# EAGLE design untitled (EAGLE 5.07)
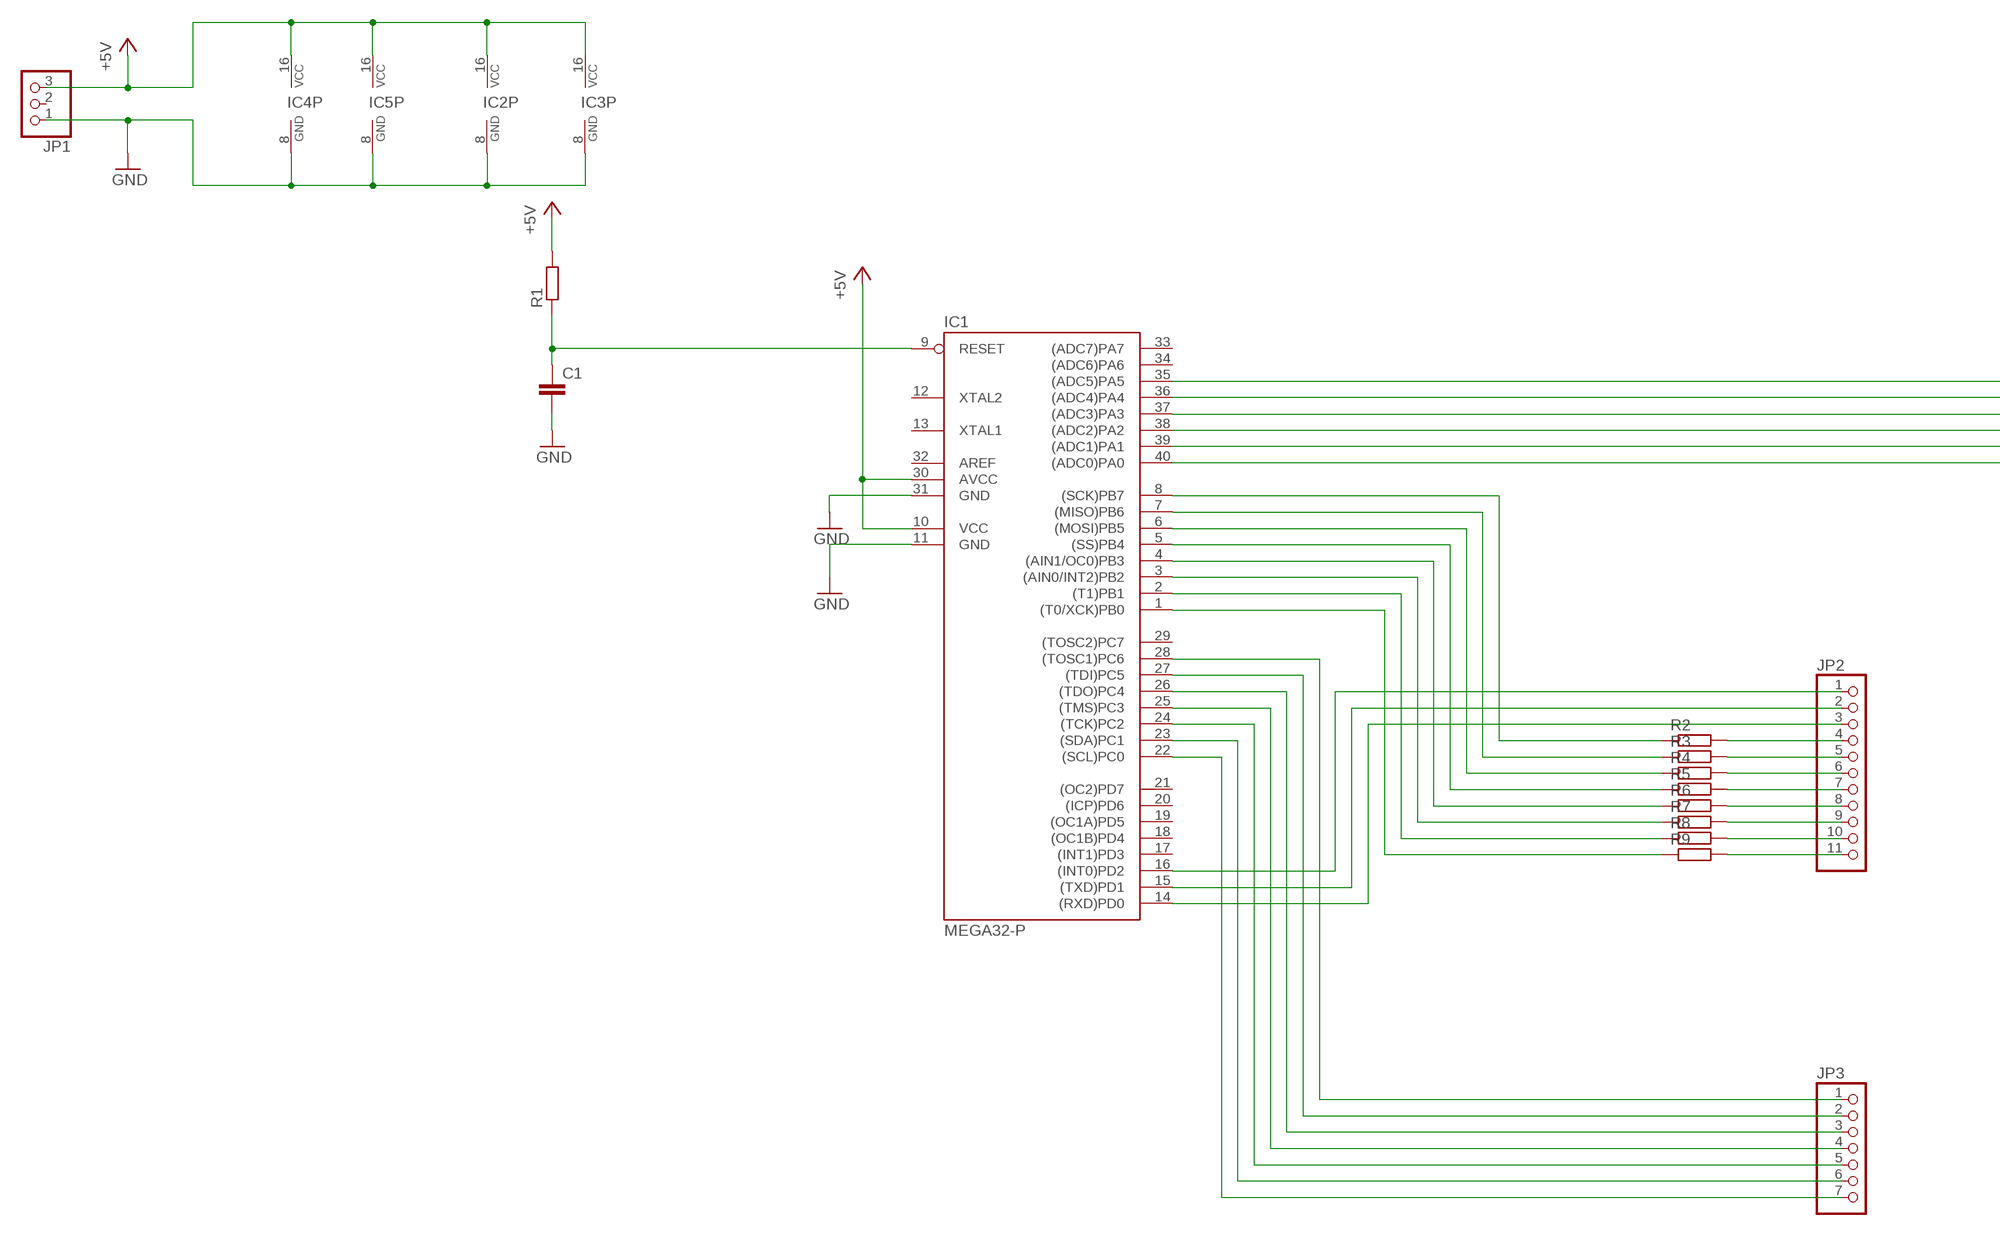
[diagram p0: schematic, sheet 1, part 1 of 2]
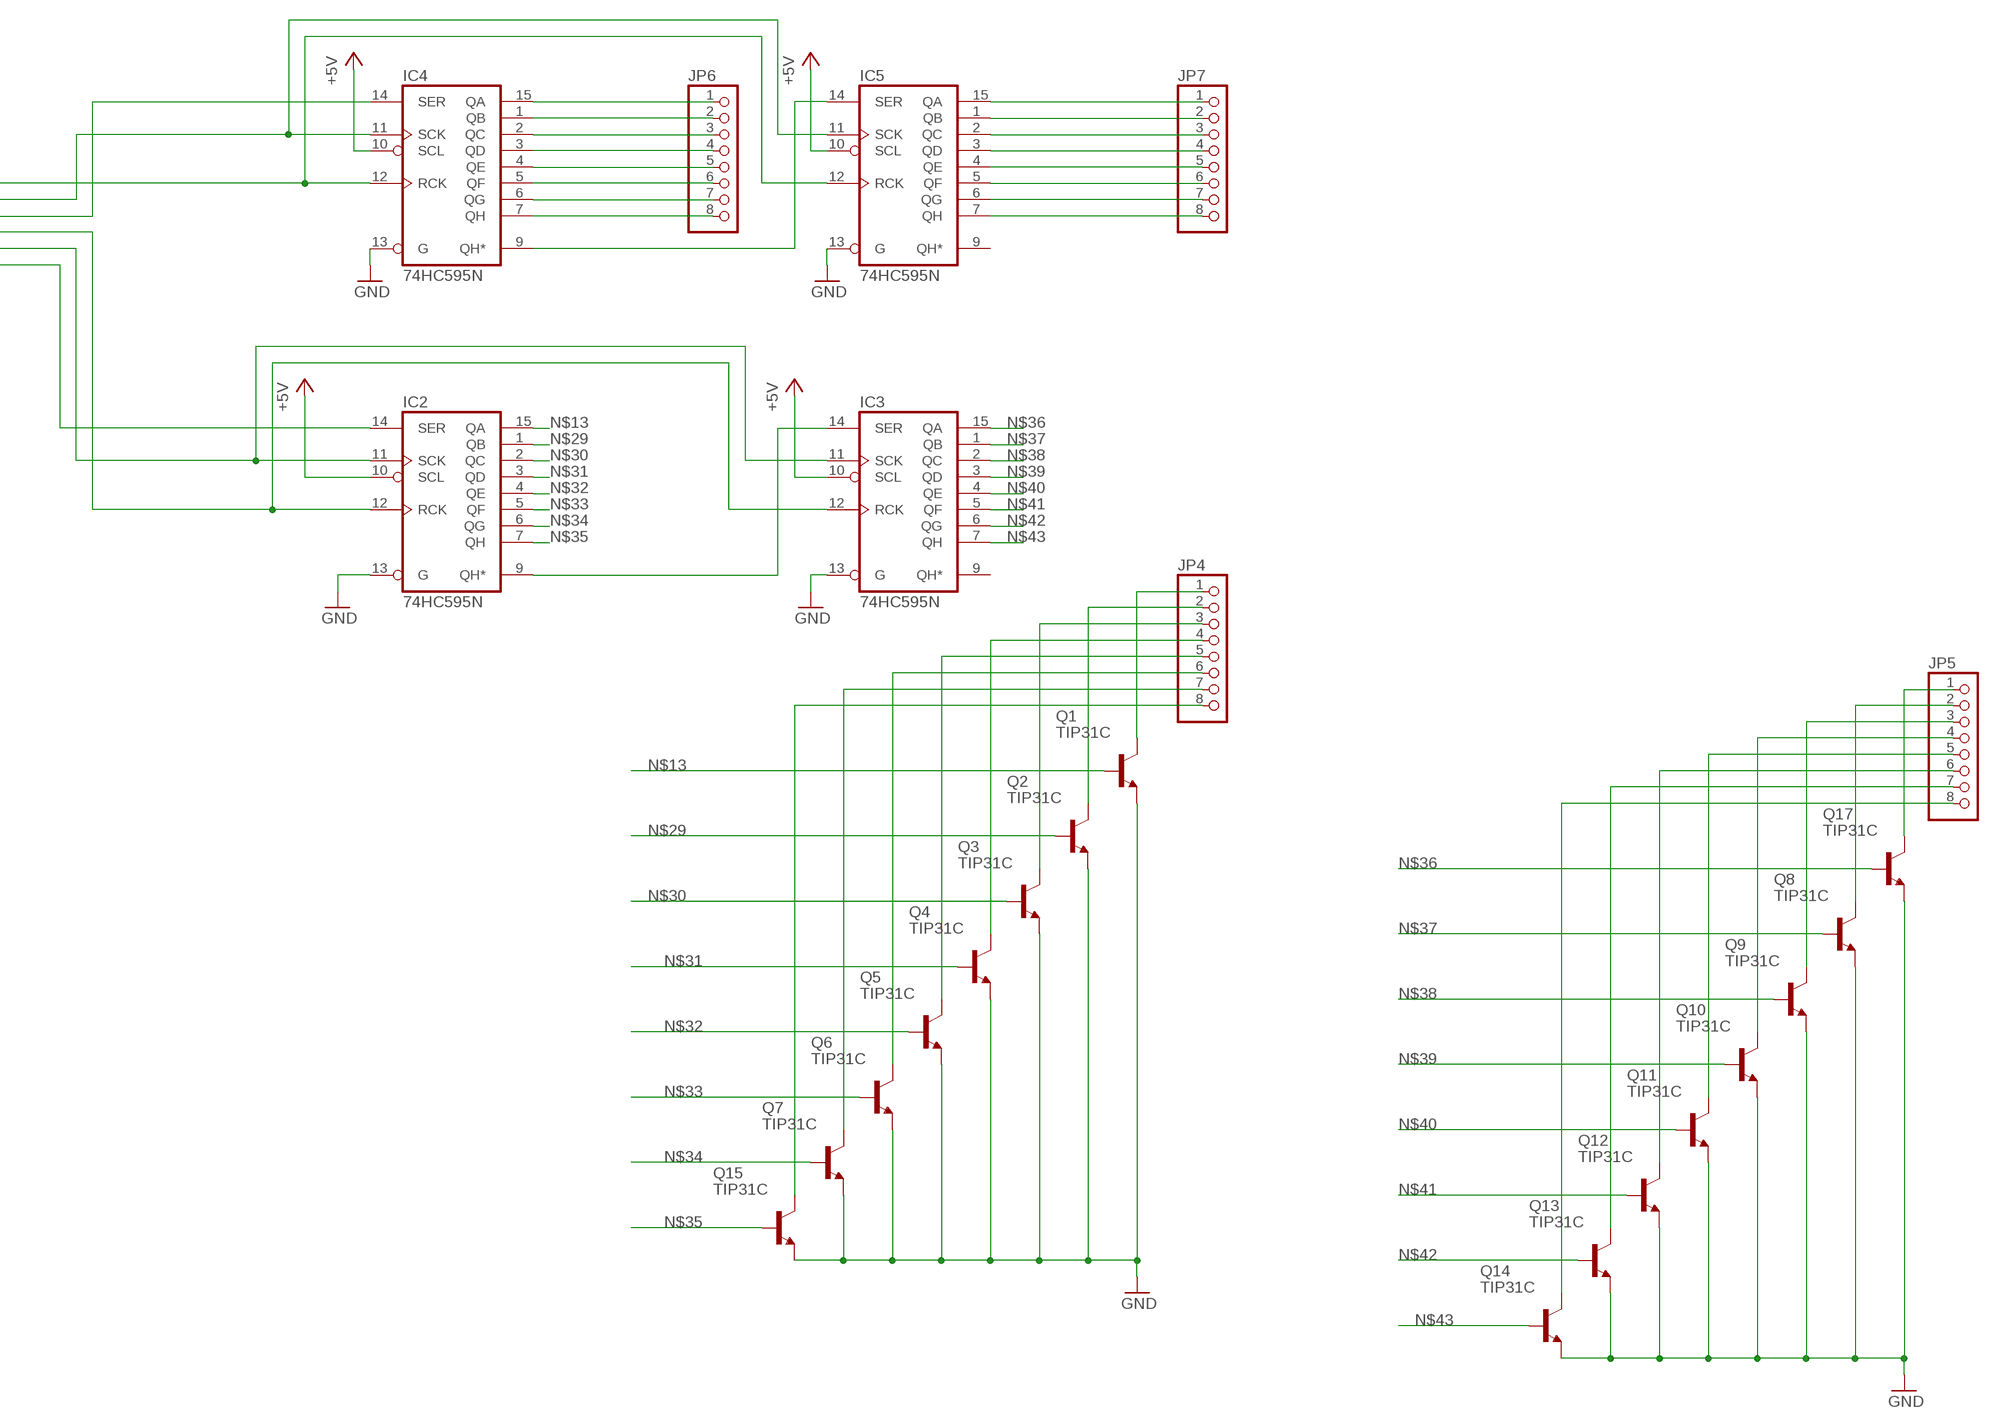
[diagram p1: schematic, sheet 1, part 2 of 2]

## Parts
C1  C-EU050-024X044  [C050-024X044]
IC1  MEGA32-P  [DIL40]
IC2  74HC595N  [DIL16]
IC3  74HC595N  [DIL16]
IC4  74HC595N  [DIL16]
IC5  74HC595N  [DIL16]
JP1  PINHD-1X3/90  [1X03/90]
JP2  PINHD-1X11/90  [1X11/90]
JP3  PINHD-1X7/90  [1X07/90]
JP4  PINHD-1X8/90  [1X08/90]
JP5  PINHD-1X8/90  [1X08/90]
JP6  PINHD-1X8/90  [1X08/90]
JP7  PINHD-1X8/90  [1X08/90]
Q1  TIP31C  [TO220]
Q2  TIP31C  [TO220]
Q3  TIP31C  [TO220]
Q4  TIP31C  [TO220]
Q5  TIP31C  [TO220]
Q6  TIP31C  [TO220]
Q7  TIP31C  [TO220]
Q8  TIP31C  [TO220]
Q9  TIP31C  [TO220]
Q10  TIP31C  [TO220]
Q11  TIP31C  [TO220]
Q12  TIP31C  [TO220]
Q13  TIP31C  [TO220]
Q14  TIP31C  [TO220]
Q15  TIP31C  [TO220]
Q17  TIP31C  [TO220]
R1  R-EU_0204/7  [0204/7]
R2  R-EU_0204/7  [0204/7]
R3  R-EU_0204/7  [0204/7]
R4  R-EU_0204/7  [0204/7]
R5  R-EU_0204/7  [0204/7]
R6  R-EU_0204/7  [0204/7]
R7  R-EU_0204/7  [0204/7]
R8  R-EU_0204/7  [0204/7]
R9  R-EU_0204/7  [0204/7]

## Nets
+5V: IC1.10(VCC) IC1.30(AVCC) IC2.10(SCL) IC2.16(VCC) IC3.10(SCL) IC3.16(VCC) IC4.10(SCL) IC4.16(VCC) IC5.10(SCL) IC5.16(VCC) JP1.3 R1.2
GND: C1.2 IC1.11(GND) IC1.31(GND) IC2.8(GND) IC2.13(G) IC3.8(GND) IC3.13(G) IC4.8(GND) IC4.13(G) IC5.8(GND) IC5.13(G) JP1.1 Q1.3(E) Q2.3(E) Q3.3(E) Q4.3(E) Q5.3(E) Q6.3(E) Q7.3(E) Q8.3(E) Q9.3(E) Q10.3(E) Q11.3(E) Q12.3(E) Q13.3(E) Q14.3(E) Q15.3(E) Q17.3(E)
N$1: IC2.9(QH*) IC3.14(SER)
N$2: IC1.40((ADC0)PA0) IC2.14(SER)
N$3: IC1.39((ADC1)PA1) IC2.11(SCK) IC3.11(SCK)
N$4: IC1.38((ADC2)PA2) IC2.12(RCK) IC3.12(RCK)
N$5: IC1.37((ADC3)PA3) IC4.14(SER)
N$6: IC1.36((ADC4)PA4) IC4.11(SCK) IC5.11(SCK)
N$7: IC1.35((ADC5)PA5) IC4.12(RCK) IC5.12(RCK)
N$8: IC4.9(QH*) IC5.14(SER)
N$9: C1.1 IC1.9(RESET) R1.1
N$10: IC1.14((RXD)PD0) JP2.3
N$11: IC1.15((TXD)PD1) JP2.2
N$12: IC1.16((INT0)PD2) JP2.1
N$13: IC2.15(QA) Q1.1(B)
N$14: IC1.8((SCK)PB7) R2.1
N$15: IC1.7((MISO)PB6) R3.1
N$16: IC1.6((MOSI)PB5) R4.1
N$17: IC1.5((SS)PB4) R5.1
N$18: IC1.4((AIN1/OC0)PB3) R6.1
N$19: IC1.3((AIN0/INT2)PB2) R7.1
N$20: IC1.2((T1)PB1) R8.1
N$21: IC1.1((T0/XCK)PB0) R9.1
N$22: IC1.22((SCL)PC0) JP3.7
N$23: IC1.23((SDA)PC1) JP3.6
N$24: IC1.24((TCK)PC2) JP3.5
N$25: IC1.25((TMS)PC3) JP3.4
N$26: IC1.26((TDO)PC4) JP3.3
N$27: IC1.27((TDI)PC5) JP3.2
N$28: IC1.28((TOSC1)PC6) JP3.1
N$29: IC2.1(QB) Q2.1(B)
N$30: IC2.2(QC) Q3.1(B)
N$31: IC2.3(QD) Q4.1(B)
N$32: IC2.4(QE) Q5.1(B)
N$33: IC2.5(QF) Q6.1(B)
N$34: IC2.6(QG) Q7.1(B)
N$35: IC2.7(QH) Q15.1(B)
N$36: IC3.15(QA) Q17.1(B)
N$37: IC3.1(QB) Q8.1(B)
N$38: IC3.2(QC) Q9.1(B)
N$39: IC3.3(QD) Q10.1(B)
N$40: IC3.4(QE) Q11.1(B)
N$41: IC3.5(QF) Q12.1(B)
N$42: IC3.6(QG) Q13.1(B)
N$43: IC3.7(QH) Q14.1(B)
N$44: JP4.1 Q1.2(C)
N$45: JP4.2 Q2.2(C)
N$46: JP4.3 Q3.2(C)
N$47: JP4.4 Q4.2(C)
N$48: JP4.5 Q5.2(C)
N$49: JP4.6 Q6.2(C)
N$50: JP4.7 Q7.2(C)
N$51: JP4.8 Q15.2(C)
N$53: JP5.1 Q17.2(C)
N$54: JP5.2 Q8.2(C)
N$55: JP5.3 Q9.2(C)
N$56: JP5.4 Q10.2(C)
N$57: JP5.5 Q11.2(C)
N$58: JP5.6 Q12.2(C)
N$59: JP5.7 Q13.2(C)
N$60: IC4.15(QA) JP6.1
N$61: IC4.1(QB) JP6.2
N$62: IC4.2(QC) JP6.3
N$63: IC4.3(QD) JP6.4
N$64: IC4.4(QE) JP6.5
N$65: IC4.5(QF) JP6.6
N$66: IC4.6(QG) JP6.7
N$67: IC4.7(QH) JP6.8
N$68: IC5.15(QA) JP7.1
N$69: IC5.1(QB) JP7.2
N$70: IC5.2(QC) JP7.3
N$71: IC5.3(QD) JP7.4
N$72: IC5.4(QE) JP7.5
N$73: IC5.5(QF) JP7.6
N$74: IC5.6(QG) JP7.7
N$75: IC5.7(QH) JP7.8
N$76: JP2.4 R2.2
N$77: JP2.5 R3.2
N$78: JP2.6 R4.2
N$79: JP2.7 R5.2
N$80: JP2.8 R6.2
N$81: JP2.9 R7.2
N$82: JP2.10 R8.2
N$83: JP2.11 R9.2
N$84: JP5.8 Q14.2(C)
Unconnected: IC1.12(XTAL2) IC1.13(XTAL1) IC1.17((INT1)PD3) IC1.18((OC1B)PD4) IC1.19((OC1A)PD5) IC1.20((ICP)PD6) IC1.21((OC2)PD7) IC1.29((TOSC2)PC7) IC1.32(AREF) IC1.33((ADC7)PA7) IC1.34((ADC6)PA6) IC3.9(QH*) IC5.9(QH*) JP1.2

## Library data of the parts
C1 = rcl:C-EU: CAPACITOR, European symbol
IC1 = atmel:MEGA32-P: MICROCONTROLLER 32 Kbytes FLASH 2 Kbytes SRAM 1 Kbytes EEPROM USART 8-channel 10 bit ADC Source: www.atmel.com .. doc2503.pdf
IC2-IC5 = 74xx-eu:74*595: 8-bit SHIFT REGISTER, output latch
JP1 = pinhead:PINHD-1X3: PIN HEADER
JP2 = pinhead:PINHD-1X11: PIN HEADER
JP3 = pinhead:PINHD-1X7: PIN HEADER
JP4-JP7 = pinhead:PINHD-1X8: PIN HEADER
Q1-Q15 Q17 = transistor-npn:TIP31C*: NPN Transistor
R1-R9 = rcl:R-EU_: RESISTOR, European symbol

## Board
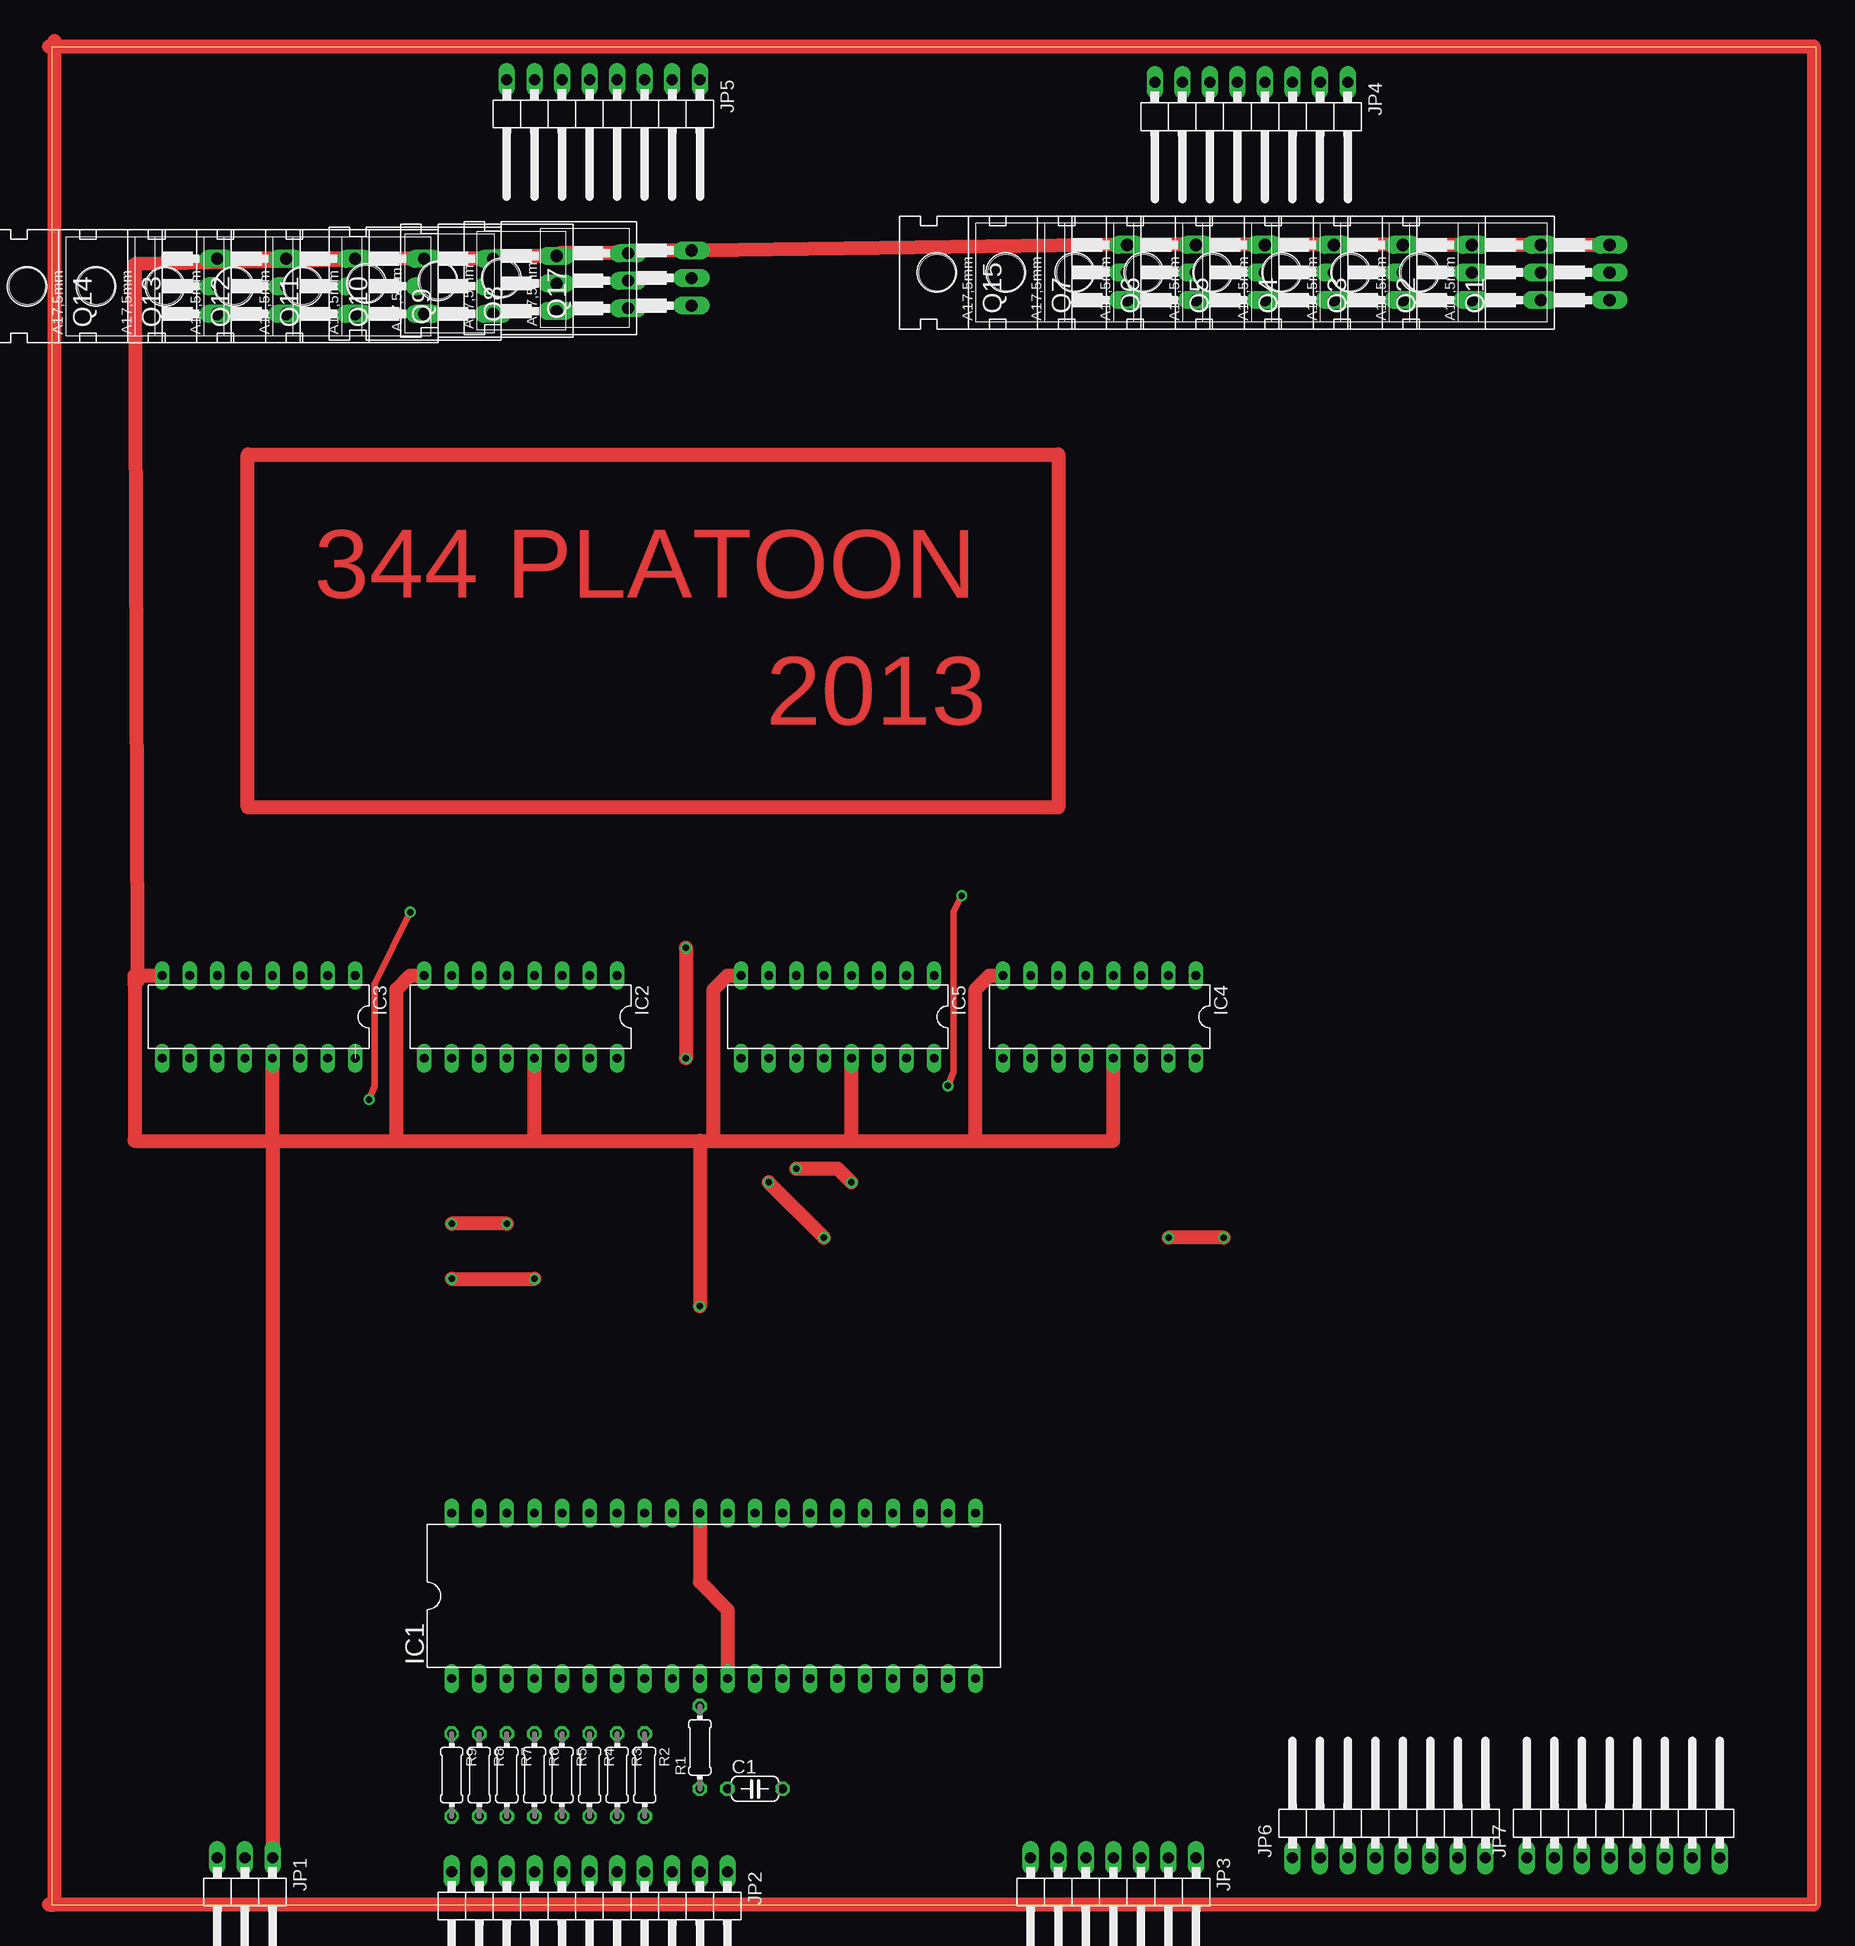
[diagram p2: board, top side]
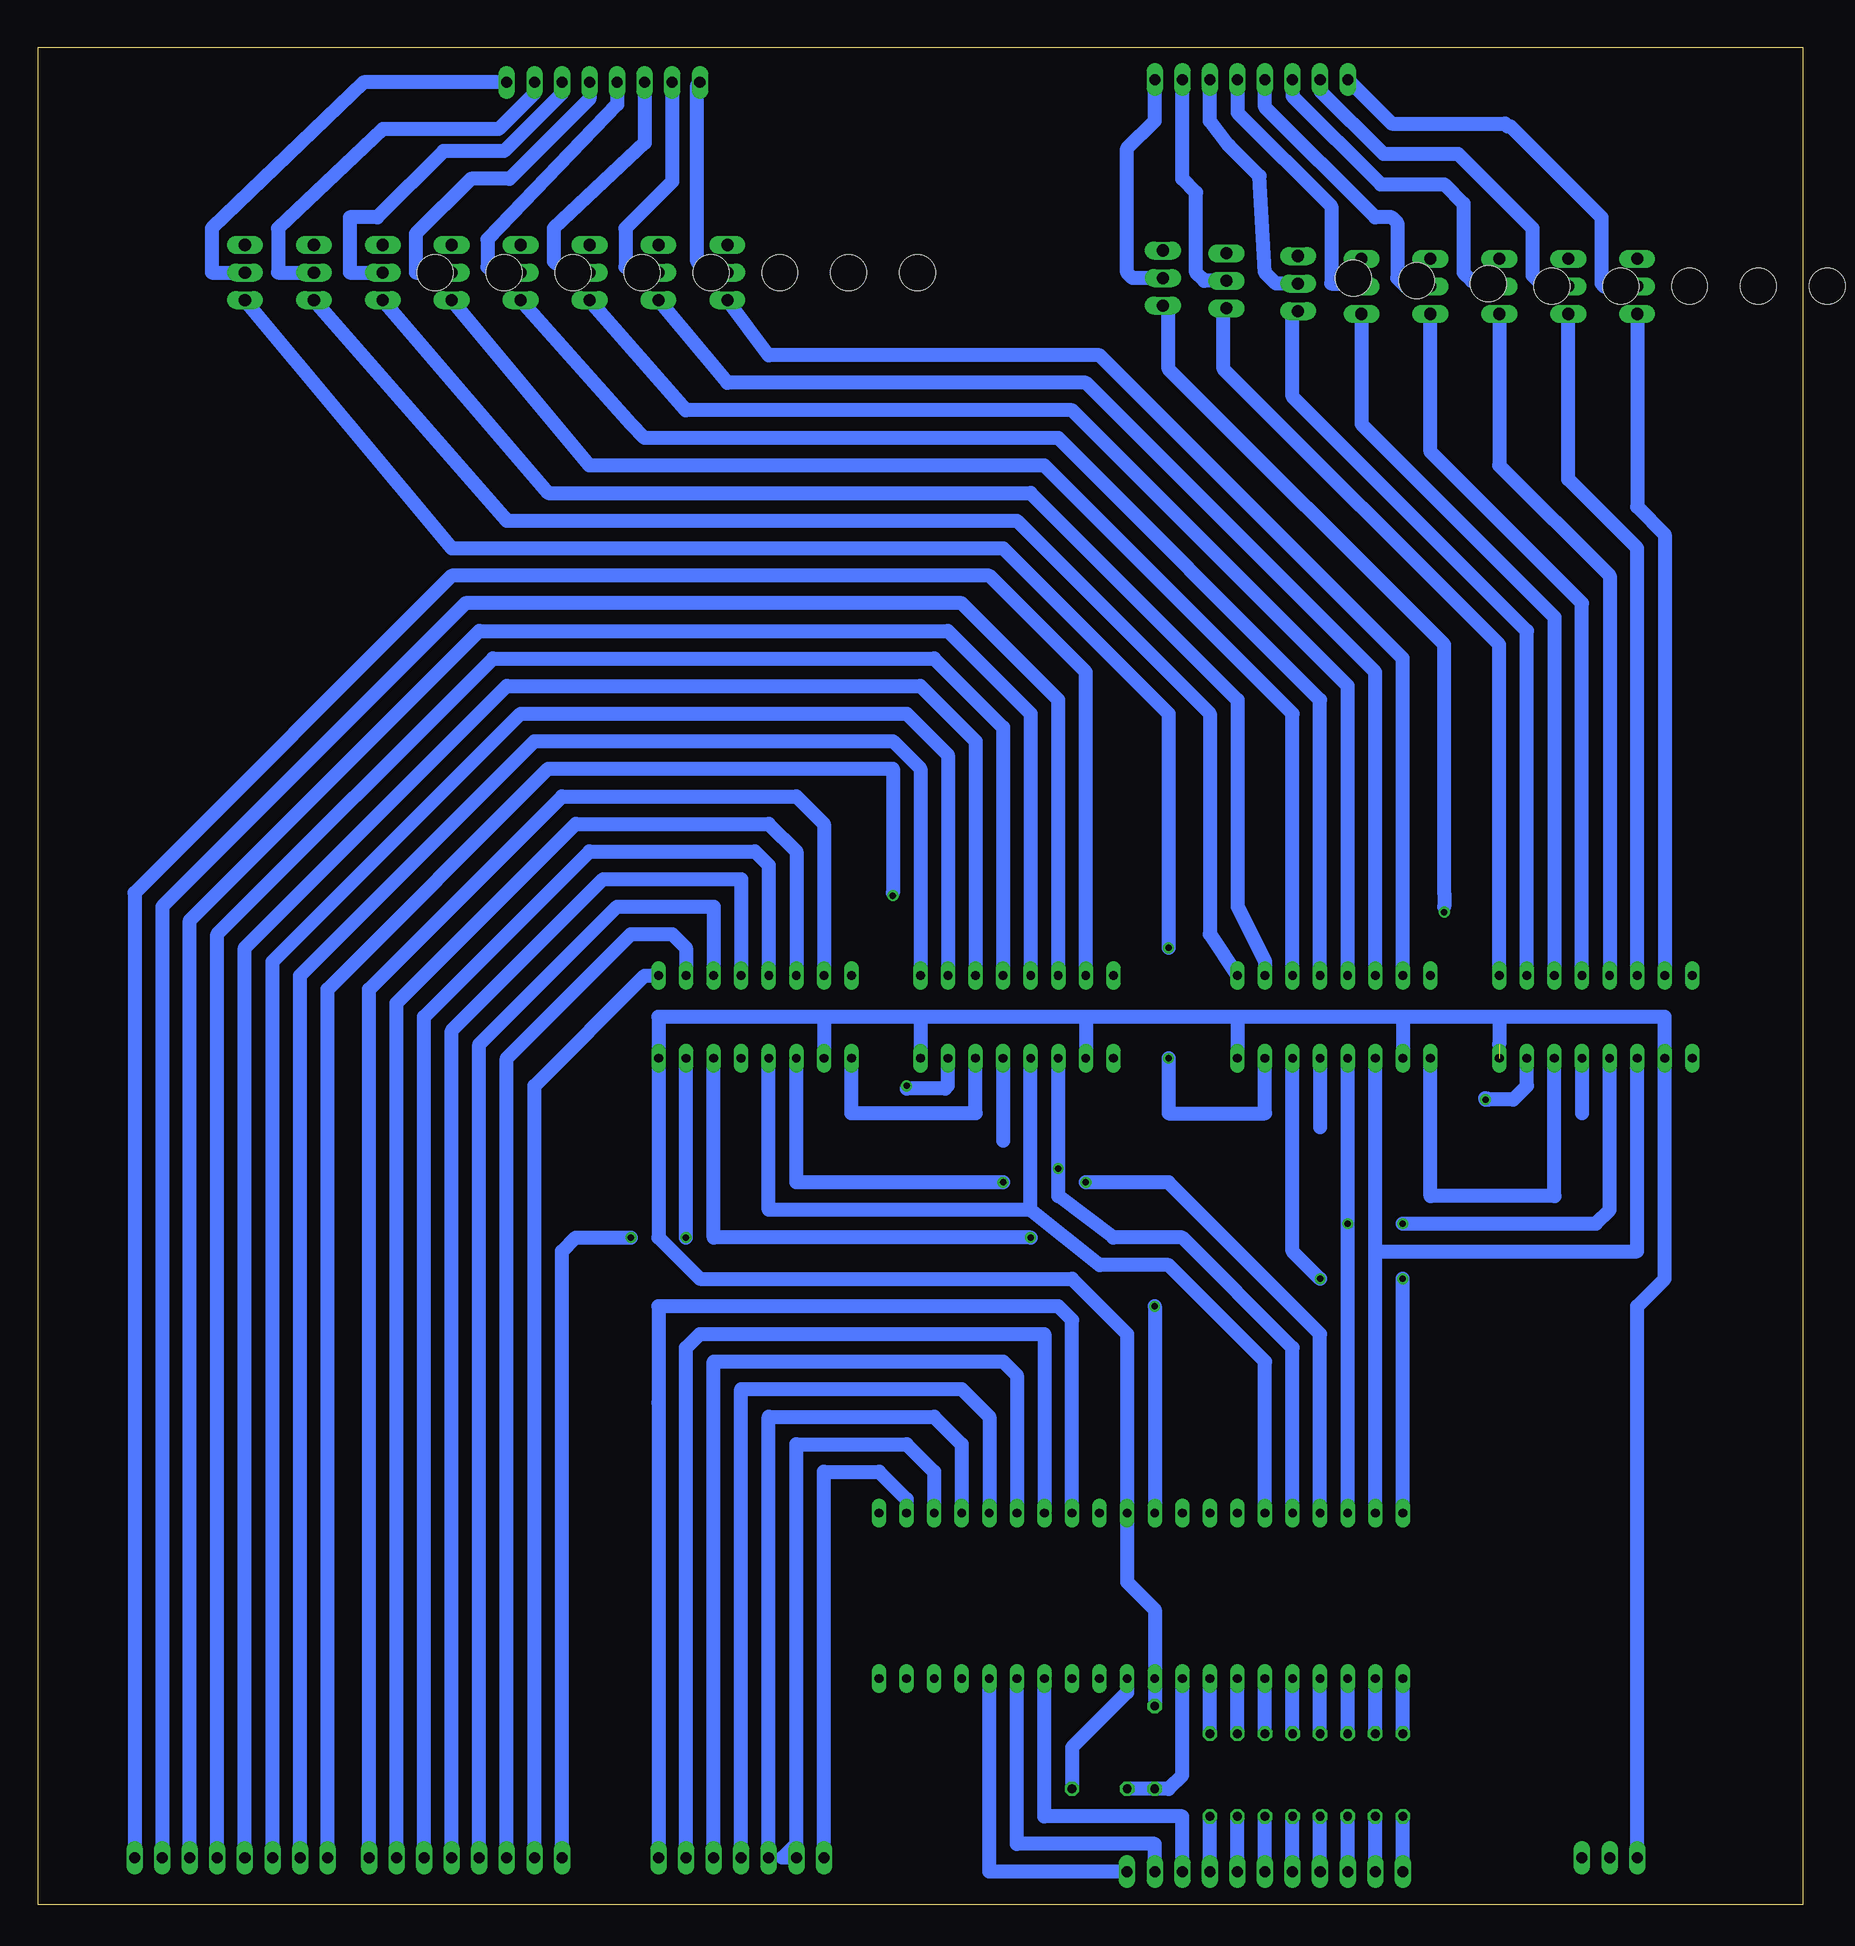
[diagram p3: board, bottom side, seen from below]

Size 162.54 x 171.12 mm. Coordinates in mm from the lower left corner, seen from the top.
Outline: 0,0 162.54,0 162.54,171.12 0,171.12 0,0
Copper layers (1*16): Top 0.035mm / dielectric 1.5mm / Bottom 0.035mm
Design rules "default *": minimum track width 10mil, minimum drill 24mil, track to track 8mil, track to pad 8mil, pad to pad 8mil, via to via 8mil, smd to smd 8mil, copper to edge 40mil, drill to drill 8mil, minimum pad ring 10mil, minimum via ring 8mil, stop-mask expansion 4mil, vias tented up to drill 0mil, thermal gap 10mil

### Footprints (pad centres in the part's own frame; a part is rotated, then mirrored left to right if it is on the bottom)
C050-024X044 = drill 0.813 octagon: 1 -2.54,0; 2 2.54,0
DIL40 = drill 0.813 long: 1 -24.13,-7.62; 2 -21.59,-7.62; 3 -19.05,-7.62; 4 -16.51,-7.62; 5 -13.97,-7.62; 6 -11.43,-7.62; 7 -8.89,-7.62; 8 -6.35,-7.62; 9 -3.81,-7.62; 10 -1.27,-7.62; 11 1.27,-7.62; 12 3.81,-7.62; 13 6.35,-7.62; 14 8.89,-7.62; 15 11.43,-7.62; 16 13.97,-7.62; 17 16.51,-7.62; 18 19.05,-7.62; 19 21.59,-7.62; 20 24.13,-7.62; 21 24.13,7.62; 22 21.59,7.62; 23 19.05,7.62; 24 16.51,7.62; 25 13.97,7.62; 26 11.43,7.62; 27 8.89,7.62; 28 6.35,7.62; 29 3.81,7.62; 30 1.27,7.62; 31 -1.27,7.62; 32 -3.81,7.62; 33 -6.35,7.62; 34 -8.89,7.62; 35 -11.43,7.62; 36 -13.97,7.62; 37 -16.51,7.62; 38 -19.05,7.62; 39 -21.59,7.62; 40 -24.13,7.62
DIL16 = drill 0.813 long: 1 -8.89,-3.81; 2 -6.35,-3.81; 3 -3.81,-3.81; 4 -1.27,-3.81; 5 1.27,-3.81; 6 3.81,-3.81; 7 6.35,-3.81; 8 8.89,-3.81; 9 8.89,3.81; 10 6.35,3.81; 11 3.81,3.81; 12 1.27,3.81; 13 -1.27,3.81; 14 -3.81,3.81; 15 -6.35,3.81; 16 -8.89,3.81
1X03/90 = drill 1.016 long: 1 -2.54,-3.81; 2 0,-3.81; 3 2.54,-3.81
1X11/90 = drill 1.016 long: 1 -12.7,-3.81; 2 -10.16,-3.81; 3 -7.62,-3.81; 4 -5.08,-3.81; 5 -2.54,-3.81; 6 0,-3.81; 7 2.54,-3.81; 8 5.08,-3.81; 9 7.62,-3.81; 10 10.16,-3.81; 11 12.7,-3.81
1X07/90 = drill 1.016 long: 1 -7.62,-3.81; 2 -5.08,-3.81; 3 -2.54,-3.81; 4 0,-3.81; 5 2.54,-3.81; 6 5.08,-3.81; 7 7.62,-3.81
1X08/90 = drill 1.016 long: 1 -8.89,-3.81; 2 -6.35,-3.81; 3 -3.81,-3.81; 4 -1.27,-3.81; 5 1.27,-3.81; 6 3.81,-3.81; 7 6.35,-3.81; 8 8.89,-3.81
TO220 = drill 1.118 long: 1 -2.54,-6.35; 2 0,-6.35; 3 2.54,-6.35 | hole 3.302: 0,11.176
0204/7 = drill 0.813 octagon: 1 -3.81,0; 2 3.81,0

### Placement (x,y rotation side)
C1  64.77,10.67 0 top
IC1  60.96,28.45 0 top
IC2  43.18,81.79 180 top
IC3  19.05,81.79 180 top
IC4  96.52,81.79 180 top
IC5  72.39,81.79 180 top
JP1  17.78,0.51 180 top
JP2  49.53,-0.76 180 top
JP3  97.79,0.51 180 top
JP4  110.49,164.08 180 top
JP5  50.8,164.34 180 top
JP6  123.19,8.13 0 top
JP7  144.78,8.13 0 top
Q1  137.16,150.37 90 top
Q2  130.81,150.37 90 top
Q3  124.46,150.37 90 top
Q4  118.11,150.37 90 top
Q5  111.76,150.37 90 top
Q6  105.41,150.37 90 top
Q7  99.06,150.37 90 top
Q8  46.74,149.61 90 top
Q9  40.13,149.35 90 top
Q10  34.29,149.1 90 top
Q11  27.94,149.1 90 top
Q12  21.59,149.1 90 top
Q13  15.24,149.1 90 top
Q14  8.89,149.1 90 top
Q15  92.71,150.37 90 top
Q17  52.58,149.86 90 top
R1  59.69,14.48 90 top
R2  54.61,11.94 270 top
R3  52.07,11.94 270 top
R4  49.53,11.94 270 top
R5  46.99,11.94 270 top
R6  44.45,11.94 270 top
R7  41.91,11.94 270 top
R8  39.37,11.94 270 top
R9  36.83,11.94 270 top

### Tracks (layer width: path | path; a pad name or v marks a point on that pad's centre or on a via)
+5V  (1 unrouted)
  Bottom 1.27: R1.2 IC1.10 59.69,27.18 62.23,29.72 IC1.30 62.23,52.58 67.31,57.66 101.6,57.66 105.41,61.47 IC4.16 105.41,81.79 90.17,81.79 | JP1.3 15.24,55.12 12.7,57.66 IC3.10 12.7,81.79 27.94,81.79 | 36.83,81.79 IC2.10 | 27.94,81.79 36.83,81.79 | 27.94,81.79 27.94,79.25 | 36.83,81.79 52.07,81.79 | 52.07,81.79 IC2.16 | 52.07,81.79 66.04,81.79 | 90.17,81.79 IC4.10 | 81.28,81.79 IC5.16 | 81.28,81.79 90.17,81.79 | 66.04,81.79 IC5.10 | 66.04,81.79 81.28,81.79
GND  (via drill 0.6)
  Top 1.27: 20.32,70.36 JP1.1 | IC3.8 7.62,85.6 7.62,84.84 | 7.62,84.84 7.62,70.36 20.32,70.36 | 20.32,70.36 IC3.13 | IC2.8 33.02,85.6 31.75,84.33 31.75,70.36 | 20.32,70.36 31.75,70.36 | 44.45,70.36 IC2.13 | 31.75,70.36 44.45,70.36 | IC5.8 62.23,85.6 60.96,84.33 60.96,70.36 | 44.45,70.36 59.69,70.36 | 59.69,70.36 60.96,70.36 | 60.96,70.36 73.66,70.36 | 73.66,70.36 IC5.13 | IC4.8 86.36,85.6 85.09,84.33 85.09,70.36 | 73.66,70.36 85.09,70.36 | IC4.13 97.79,70.36 85.09,70.36 | 59.69,70.36 v59.69,55.12 | IC1.31 59.69,29.72 62.23,27.18 IC1.11 | Q1.3 Q2.3 Q3.3 Q4.3 Q5.3 Q6.3 Q7.3 Q15.3 59.94,152.4 Q17.3 53.34,152.4 Q8.3 46.74,152.15 Q9.3 40.89,151.89 Q10.3 Q11.3 | Q11.3 Q12.3 Q13.3 Q14.3 | Q14.3 14.73,151.64 14.48,151.38 14.99,151.38 Q14.3 | Q11.3 7.62,151.13 7.87,87.88 7.87,85.09 7.62,84.84
  Bottom 1.27: C1.2 67.31,14.48 62.23,19.56 IC1.11 | IC2.13 44.45,71.63 | IC3.13 20.32,72.9 | IC5.13 73.66,70.36 | v59.69,55.12 IC1.31
  pour Top: 195.83,98.04 274.07,98.04 274.07,61.47 195.33,61.47 195.33,98.04
N$1
  Bottom 1.27: IC3.14 22.86,65.28 34.29,65.28 IC2.9
N$2  (via drill 0.6)
  Top 1.27: v36.83,57.66 v44.45,57.66
  Bottom 1.27: IC2.14 46.99,60.2 v44.45,57.66 | IC1.40 v36.83,57.66
N$3
  Bottom 1.27: IC1.39 39.37,60.2 | 39.37,60.2 IC2.11 | IC3.11 15.24,60.2 39.37,60.2
N$4  (via drill 0.6)
  Top 1.27: v41.91,62.74 v36.83,62.74
  Bottom 1.27: IC1.38 v41.91,62.74 IC2.12 | IC3.12 17.78,64.01 19.05,62.74 v36.83,62.74
N$5  (via drill 0.6)
  Top 1.27: v66.04,66.55 v71.12,61.47
  Bottom 1.27: IC1.37 44.45,52.58 58.42,66.55 v66.04,66.55 | IC4.14 100.33,61.47 v71.12,61.47
N$6  (via drill 0.6)
  Top 1.27: v73.66,66.55 72.39,67.82 v68.58,67.82
  Bottom 1.27: IC1.36 46.99,51.31 57.15,61.47 63.5,61.47 68.58,65.28 v68.58,67.82 IC5.11 | IC4.11 92.71,66.55 v73.66,66.55
N$7
  Bottom 1.27: IC1.35 49.53,50.04 58.42,58.93 64.77,58.93 71.12,64.01 | 71.12,64.01 IC5.12 | IC4.12 95.25,64.01 71.12,64.01
N$8
  Bottom 1.27: IC5.14 76.2,72.9 87.63,72.9 IC4.9
N$9
  Bottom 1.27: C1.1 R1.1 58.42,10.67 57.15,11.94 IC1.9
N$10
  Bottom 1.27: JP2.3 57.15,8.13 69.85,8.13 IC1.14
N$11
  Bottom 1.27: JP2.2 59.69,5.59 72.39,5.59 IC1.15
N$12
  Bottom 1.27: JP2.1 74.93,3.05 IC1.16
N$13  (via drill 0.6)
  Top 1.27: v58.42,88.14 v58.42,77.98
  Bottom 1.27: IC2.15 49.53,72.9 58.42,72.9 v58.42,77.98 | v58.42,88.14 58.42,109.73 73.66,124.97 124.46,124.97 Q1.1
N$14
  Bottom 1.27: R2.1 IC1.8
N$15
  Bottom 1.27: R3.1 IC1.7
N$16
  Bottom 1.27: R4.1 IC1.6
N$17
  Bottom 1.27: R5.1 IC1.5
N$18
  Bottom 1.27: R6.1 IC1.4
N$19
  Bottom 1.27: R7.1 IC1.3
N$20
  Bottom 1.27: R8.1 IC1.2
N$21
  Bottom 1.27: R9.1 IC1.1
N$22
  Bottom 1.27: IC1.22 82.55,37.34 85.09,39.88 90.17,39.88 90.17,38.61 JP3.7
N$23
  Bottom 1.27: IC1.23 80.01,39.88 82.55,42.42 92.71,42.42 92.71,5.59 93.98,4.32 JP3.6
N$24
  Bottom 1.27: IC1.24 77.47,42.42 80.01,44.96 95.25,44.96 JP3.5
N$25
  Bottom 1.27: IC1.25 74.93,44.96 77.47,47.5 97.79,47.5 JP3.4
N$26
  Bottom 1.27: JP3.3 100.33,50.04 73.66,50.04 72.39,48.77 IC1.26
N$27
  Bottom 1.27: IC1.27 69.85,52.58 101.6,52.58 102.87,51.31 JP3.2
N$28
  Bottom 1.27: IC1.28 67.31,53.85 68.58,55.12 105.41,55.12 105.41,46.23 JP3.1
N$29
  Bottom 1.27: IC2.1 54.61,89.41 54.61,109.73 72.39,127.51 119.38,127.51 Q2.1
N$30
  Bottom 1.27: IC2.2 49.53,86.87 52.07,91.95 52.07,111 71.12,130.05 115.57,130.05 Q3.1
N$31
  Bottom 1.27: IC2.3 46.99,109.73 69.85,132.59 111.76,132.59 Q4.1
N$32
  Bottom 1.27: IC2.4 44.45,111 68.58,135.13 106.68,135.13 107.95,136.4 Q5.1
N$33
  Bottom 1.27: IC2.5 41.91,112.27 67.31,137.67 102.87,137.67 Q6.1
N$34
  Bottom 1.27: IC2.6 39.37,113.54 66.04,140.21 99.06,140.21 Q7.1
N$35
  Bottom 1.27: IC2.7 36.83,114.81 64.77,142.75 95.25,142.75 Q15.1
N$36  (via drill 0.6)
  Top 0.61: v33.02,91.44 29.72,84.84 29.72,75.44 v29.21,74.17
  Bottom 0.61: v33.02,91.44 33.02,91.95
  Bottom 1.27: IC3.15 25.4,75.44 26.67,74.17 28.96,74.17 29.24,74.3 v29.21,74.17 | Q17.1 58.42,146.81 58.42,141.48 33.02,116.08 33.02,93.47 33.02,93.22 33.02,91.95
N$37
  Bottom 1.27: IC3.1 27.94,116.08 53.34,141.48 53.34,146.81 Q8.1
N$38
  Bottom 1.27: IC3.2 25.4,117.35 46.99,138.94 46.99,146.3 Q9.1
N$39
  Bottom 1.27: Q10.1 40.64,136.4 22.86,118.62 IC3.3
N$40
  Bottom 1.27: IC3.4 20.32,119.89 34.29,133.86 Q11.1
N$41
  Bottom 1.27: Q12.1 27.94,132.59 17.78,122.43 IC3.5
N$42
  Bottom 1.27: IC3.6 15.24,124.97 21.59,131.32 Q13.1
N$43
  Bottom 1.27: Q14.1 15.24,128.78 12.7,126.24 IC3.7
N$44
  Bottom 1.27: JP4.1 132.59,167.89 146.56,154.43 146.56,150.37 Q1.2
N$45
  Bottom 1.27: JP4.2 116.84,166.88 120.14,163.58 130.81,163.58 140.46,154.43 140.46,150.37 Q2.2
N$46
  Bottom 1.27: JP4.3 114.3,166.88 119.63,161.54 125.22,161.54 131.32,155.45 133.86,155.45 133.86,150.37 Q3.2
N$47
  Bottom 1.27: JP4.4 111.76,166.37 119.13,159 122.68,159 127.76,153.92 127.76,150.37 Q4.2
N$48
  Bottom 1.27: JP4.5 109.22,165.86 121.16,153.42 121.16,150.88 120.14,150.37 Q5.2
N$49
  Bottom 1.27: JP4.6 106.68,162.31 115.06,154.43 115.06,151.38 113.54,150.37 Q6.2
N$50
  Bottom 1.27: JP4.7 104.14,158.75 108.46,154.43 108.46,150.88 107.95,150.88 107.44,150.37 Q7.2
N$51
  Bottom 1.27: Q15.2 100.84,150.37 101.85,151.38 101.85,167.64 JP4.8
N$52
  Bottom 1.27: 78.99,75.18 82.55,75.18
N$53
  Bottom 1.27: Q17.2 61.72,149.86 62.23,150.37 62.23,161.8 59.69,164.34 JP5.1
N$54
  Bottom 1.27: Q8.2 55.12,149.61 55.88,150.37 55.88,157.73 57.15,159 JP5.2
N$55
  Bottom 1.27: Q9.2 48.51,149.35 49.53,150.37 50.04,159.26 52.83,162.05 54.61,164.34 JP5.3
N$56
  Bottom 1.27: JP5.4 52.07,165.1 43.43,156.46 43.43,149.35 40.89,149.35 Q10.2
N$57
  Bottom 1.27: JP5.5 49.53,165.61 39.37,155.45 37.85,155.45 37.34,154.94 37.34,149.86 36.58,149.1 Q11.2
N$58
  Bottom 1.27: JP5.6 46.99,166.62 38.86,158.5 33.02,158.5 31.24,156.72 31.24,150.37 30.48,149.61 30.23,149.61 29.72,149.1 Q12.2
N$59
  Bottom 1.27: JP5.7 44.45,167.13 38.61,161.29 31.75,161.29 24.89,154.43 24.89,150.11 23.88,149.1 Q13.2
N$60  (via drill 0.6)
  Top 1.27: v107.95,61.47 v102.87,61.47
  Bottom 1.27: v107.95,61.47 113.03,61.47 114.3,60.2 JP6.1 | v102.87,61.47 IC4.15
N$61
  Bottom 1.27: IC4.1 106.68,85.6 116.84,75.44 JP6.2
N$62
  Bottom 1.27: IC4.2 102.87,88.14 104.14,89.41 107.95,89.41 119.38,77.98 JP6.3
N$63
  Bottom 1.27: JP6.4 121.92,79.25 109.22,91.95 100.33,91.95 IC4.3
N$64
  Bottom 1.27: IC4.4 97.79,94.49 110.49,94.49 124.46,80.52 JP6.5
N$65
  Bottom 1.27: JP6.6 127,81.79 111.76,97.03 96.52,97.03 95.25,95.76 IC4.5
N$66
  Bottom 1.27: IC4.6 92.71,97.03 95.25,99.57 113.03,99.57 129.54,83.06 JP6.7
N$67
  Bottom 1.27: JP6.8 132.08,84.33 114.3,102.11 92.71,102.11 90.17,99.57 IC4.7
N$68  (via drill 0.6)
  Top 0.61: v82.55,75.44 83.06,76.71 83.06,91.44 v83.82,92.96
  Bottom 0.61: v82.55,75.44 78.74,75.44 | 83.82,93.22 v83.82,92.96
  Bottom 1.27: 78.74,75.44 IC5.15 | JP7.1 135.89,84.33 115.57,104.65 83.82,104.65 83.82,93.22
N$69
  Bottom 1.27: JP7.2 138.43,85.6 116.84,107.19 83.82,107.19 81.28,104.65 IC5.1
N$70
  Bottom 1.27: IC5.2 78.74,105.92 82.55,109.73 118.11,109.73 140.97,86.87 JP7.3
N$71
  Bottom 1.27: JP7.4 143.51,88.14 119.38,112.27 81.28,112.27 76.2,107.19 IC5.3
N$72
  Bottom 1.27: IC5.4 73.66,108.46 80.01,114.81 120.65,114.81 146.05,89.41 JP7.5
N$73
  Bottom 1.27: JP7.6 148.59,90.68 121.92,117.35 78.74,117.35 71.12,109.73 IC5.5
N$74
  Bottom 1.27: IC5.6 68.58,111 77.47,119.89 123.19,119.89 151.13,91.95 JP7.7
N$75
  Bottom 1.27: JP7.8 153.67,93.22 124.46,122.43 74.93,122.43 66.04,113.54 IC5.7
N$76
  Bottom 1.27: JP2.4 R2.2
N$77
  Bottom 1.27: JP2.5 R3.2
N$78
  Bottom 1.27: JP2.6 R4.2
N$79
  Bottom 1.27: JP2.7 R5.2
N$80
  Bottom 1.27: JP2.8 R6.2
N$81
  Bottom 1.27: JP2.9 R7.2
N$82
  Bottom 1.27: JP2.10 R8.2
N$83
  Bottom 1.27: JP2.11 R9.2
N$84
  Bottom 1.27: JP5.8 37.85,164.08 27.43,164.08 27.18,163.83 26.92,163.83 18.54,155.45 18.54,149.35 18.29,149.1 Q14.2
N$85
  Top 1.27: -0.25,171.2 162.31,171.2 162.31,0 0.25,0 | -0.25,0 0.25,0 | 0.25,0 0.25,171.7
N$86
  Top 1.27: 18.03,133.6 92.71,133.6 92.71,101.09 18.03,101.09 18.03,133.6

### Text on the board
Top: 344 PLATOON | 2013